# EAGLE design Callisto_RSO_PB_Relay_x_4 (EAGLE 9.6.2)
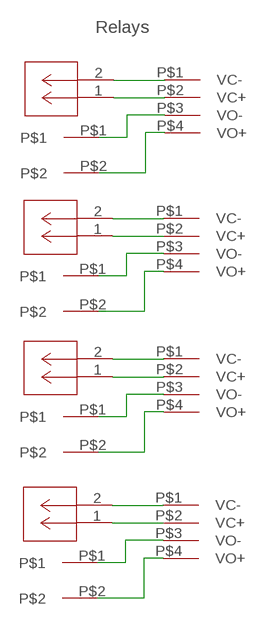
[diagram p0: schematic, sheet 1]

## Parts
J4  CONN_530470210_PICOBLADE_X_2  [CON_530470210_MOL]
J5  2-pos  3.81MM_1_X_2_RT_ANGLE_PLUG_HEADER  [2_3.81MM_PITCH]
J6  CONN_530470210_PICOBLADE_X_2  [CON_530470210_MOL]
J7  2-pos  3.81MM_1_X_2_RT_ANGLE_PLUG_HEADER  [2_3.81MM_PITCH]
J8  CONN_530470210_PICOBLADE_X_2  [CON_530470210_MOL]
J9  2-pos  3.81MM_1_X_2_RT_ANGLE_PLUG_HEADER  [2_3.81MM_PITCH]
J10  CONN_530470210_PICOBLADE_X_2  [CON_530470210_MOL]
J11  2-pos  3.81MM_1_X_2_RT_ANGLE_PLUG_HEADER  [2_3.81MM_PITCH]
U$1  RELAY_KYOTO_KF0604D  [RELAY_KYOTO_KF0604D]
U$2  RELAY_KYOTO_KF0604D  [RELAY_KYOTO_KF0604D]
U$3  RELAY_KYOTO_KF0604D  [RELAY_KYOTO_KF0604D]
U$4  RELAY_KYOTO_KF0604D  [RELAY_KYOTO_KF0604D]

## Nets
N$3: J4.1 U$1.P$2(VC+)
N$4: J4.2 U$1.P$1(VC-)
N$5: J5.P$1 U$1.P$3(VO-)
N$6: J5.P$2 U$1.P$4(VO+)
N$7: J6.1 U$2.P$2(VC+)
N$8: J6.2 U$2.P$1(VC-)
N$9: J7.P$1 U$2.P$3(VO-)
N$10: J7.P$2 U$2.P$4(VO+)
N$11: J8.1 U$3.P$2(VC+)
N$12: J8.2 U$3.P$1(VC-)
N$13: J9.P$1 U$3.P$3(VO-)
N$14: J9.P$2 U$3.P$4(VO+)
N$15: J10.1 U$4.P$2(VC+)
N$16: J10.2 U$4.P$1(VC-)
N$17: J11.P$1 U$4.P$3(VO-)
N$18: J11.P$2 U$4.P$4(VO+)

## Notes on the sheet
- Relays

## Library data of the parts
J4 J6 J8 J10 = 3D_MIG_Controller:CONN_530470210_PICOBLADE_X_2; COPYRIGHT: Copyright (C) 2022 Ultra Librarian. All rights reserved.; MANUFACTURER_PART_NUMBER: 530470210; MFR_NAME: Molex Connector Corporation
J5 J7 J9 J11 = 3D_MIG_Controller:3.81MM_1_X_2_RT_ANGLE_PLUG_HEADER: TERM BLOCK HDR 2POS 90DEG 3.81MM; PARTNO: 691322310002
U$1-U$4 = 3D_MIG_Controller:RELAY_KYOTO_KF0604D

## Board
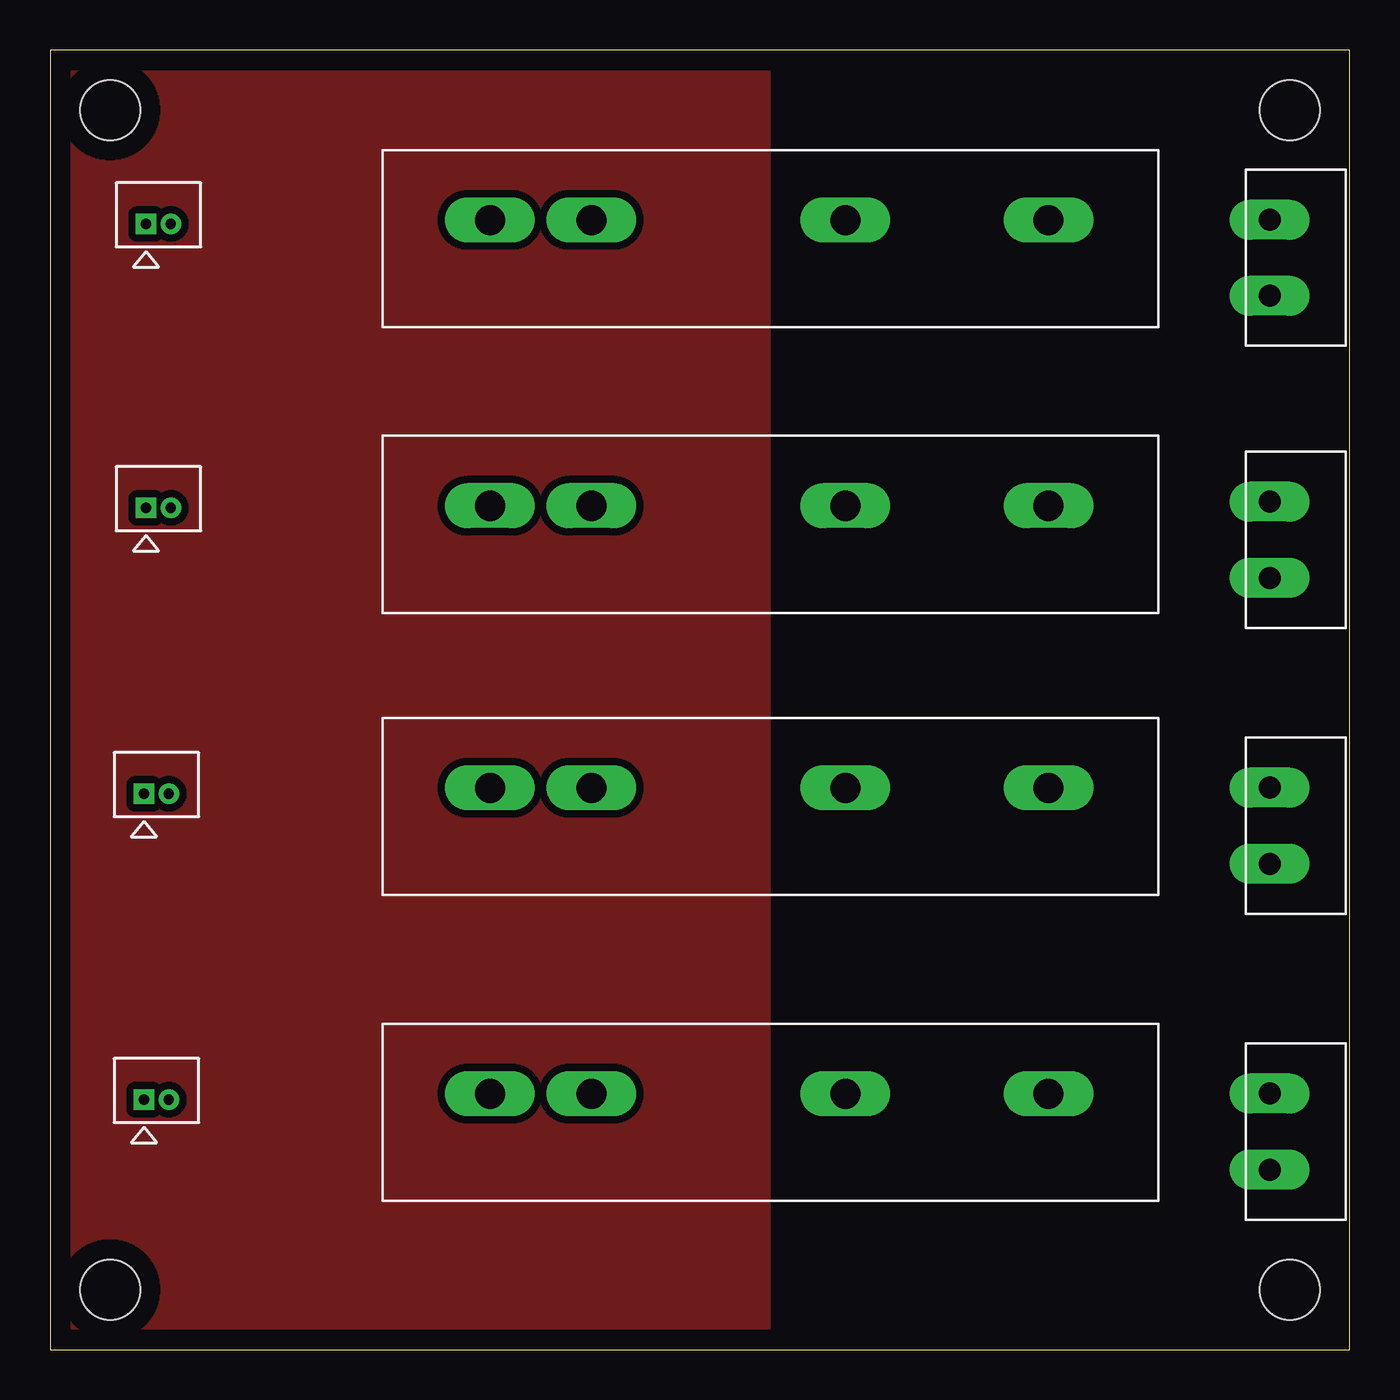
[diagram p1: board, top side]
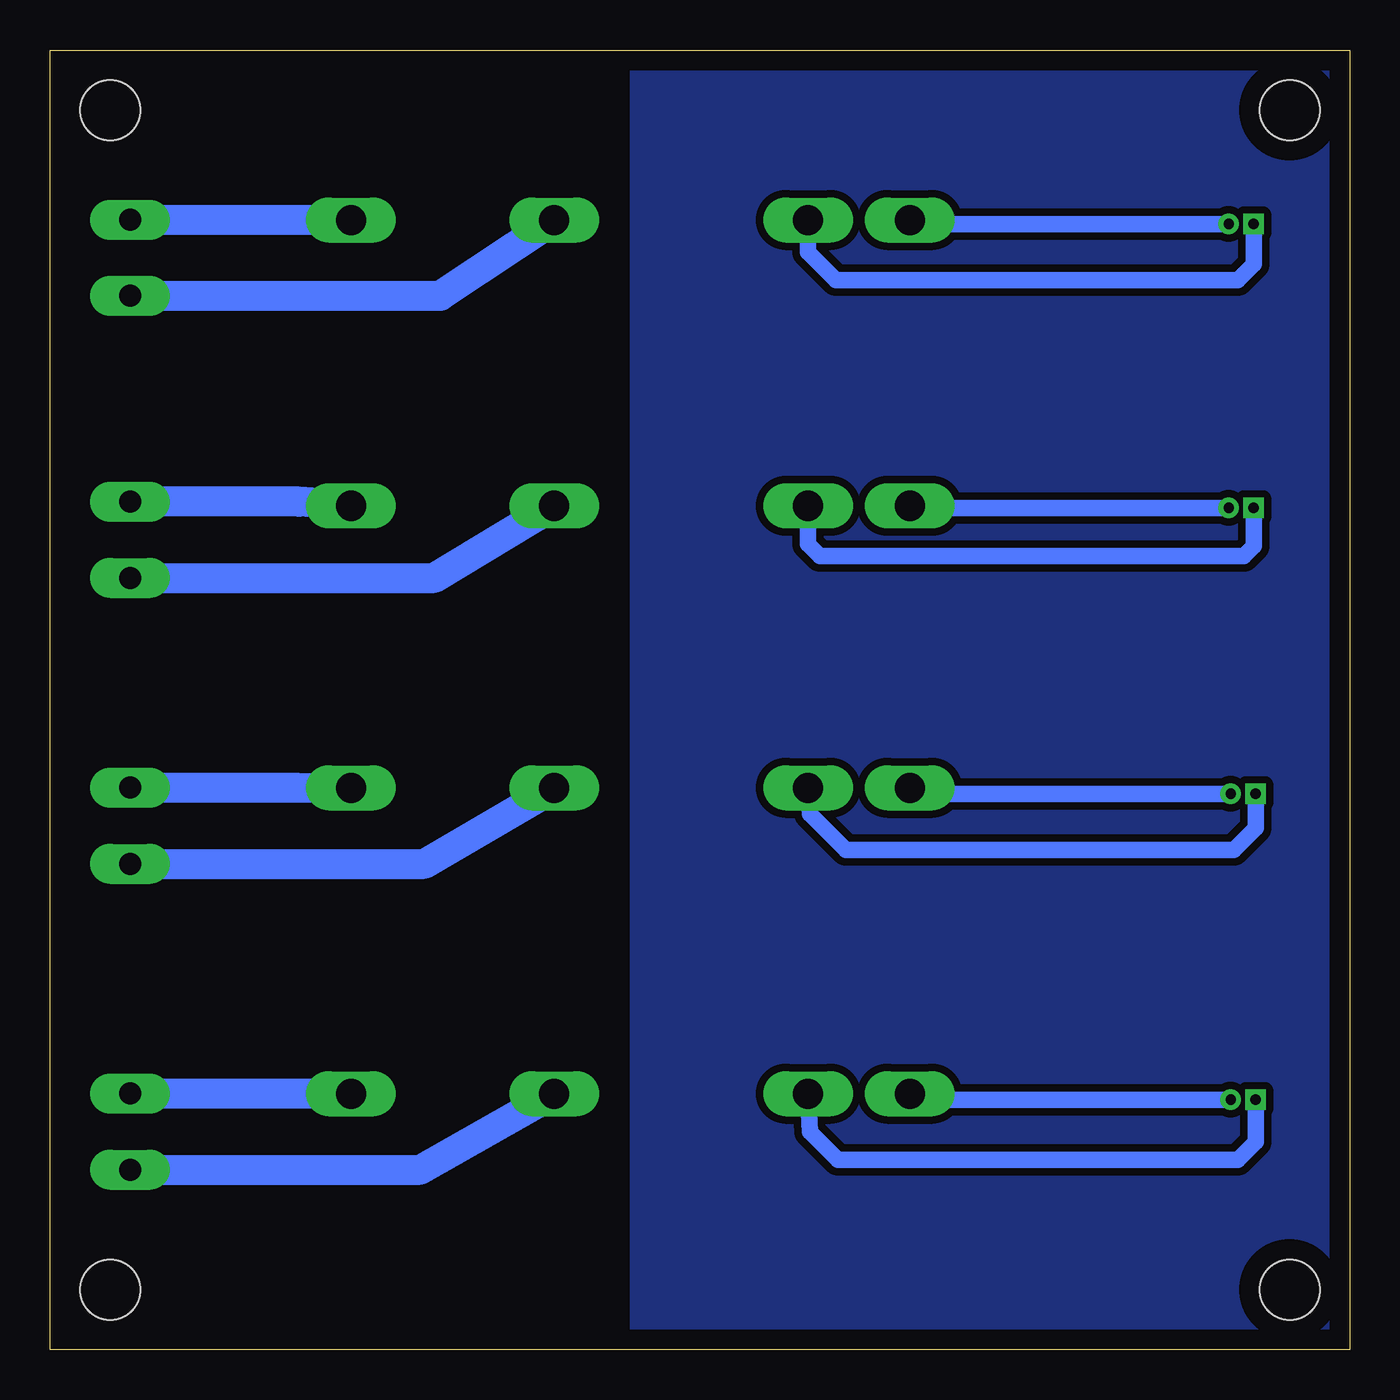
[diagram p2: board, bottom side, seen from below]

Size 65 x 65 mm. Coordinates in mm from the lower left corner, seen from the top.
Outline: 0,0 65,0 65,65 0,65 0,0
Copper layers (1*16): Top 0.035mm / dielectric 1.5mm / Bottom 0.035mm
Design rules "default *": minimum track width 6mil, minimum drill 0.2mm, track to track 15mil, track to pad 15mil, pad to pad 6mil, via to via 6mil, smd to smd 6mil, copper to edge 40mil, drill to drill 6mil, minimum pad ring 10mil, minimum via ring 4mil, stop-mask expansion 4mil, vias tented up to drill 0mil, thermal gap 10mil
Holes 3 mm at 3,3 62,3 62,62 3,62

### Footprints (pad centres in the part's own frame; a part is rotated, then mirrored left to right if it is on the bottom)
CON_530470210_MOL = drill 0.508 pad 0.838 square: 1 0,0 | drill 0.508 pad 0.838: 2 -1.245,0
2_3.81MM_PITCH = drill 1.1 pad 2 long: P$1 0,0; P$2 3.81,0
RELAY_KYOTO_KF0604D = drill 1.5 long: P$1 0,0; P$2 -5.08,0; P$3 -17.78,0; P$4 -27.94,0

### Placement (x,y rotation side)
J4  4.7,12.5 180 top
J5  61,9 90 top
J6  4.7,27.8 180 top
J7  61,24.3 90 top
J8  4.8,42.1 180 top
J9  61,38.6 90 top
J10  4.8,56.3 180 top
J11  61,52.7 90 top
U$1  22,12.8 180 top
U$2  22,28.1 180 top
U$3  22,42.2 180 top
U$4  22,56.5 180 top

### Tracks (layer width: path | path; a pad name or v marks a point on that pad's centre or on a via)
GND
  pour Bottom: 0,0 0,65 36,65 36,0
  pour Top: 0,0 0,65 36,65 36,0
N$3
  Bottom 0.813: J4.1 4.7,10.4 5.6,9.5 25.6,9.5 26.98,10.88 U$1.P$2
N$4
  Bottom 0.813: J4.2 21.6,12.5 U$1.P$1
N$5
  Bottom 1.5: J5.P$1 46.48,9 U$1.P$3
N$6
  Bottom 1.5: U$1.P$4 60.39,12.8 J5.P$2
N$7
  Bottom 0.813: J6.1 4.7,26.1 5.8,25 25.2,25 26.98,26.78 U$2.P$2
N$8
  Bottom 0.813: J6.2 21.6,27.8 U$2.P$1
N$9
  Bottom 1.5: J7.P$1 46.28,24.3 U$2.P$3
N$10
  Bottom 1.5: J7.P$2 52.65,28.11 U$2.P$4
N$11
  Bottom 0.813: J8.1 4.8,40.2 5.3,39.7 26.5,39.7 27.08,40.28 U$3.P$2
N$12
  Bottom 0.813: J8.2 21.9,42.1 U$3.P$1
N$13
  Bottom 1.5: J9.P$1 45.78,38.6 U$3.P$3
N$14
  Bottom 1.5: U$3.P$4 52.55,42.41 J9.P$2
N$15
  Bottom 0.813: J10.1 4.8,54.3 5.6,53.5 25.7,53.5 27.08,54.88 U$4.P$2
N$16
  Bottom 0.813: J10.2 21.8,56.3 U$4.P$1
N$17
  Bottom 1.5: J11.P$1 45.48,52.7 U$4.P$3
N$18
  Bottom 1.5: J11.P$2 51.85,56.51 U$4.P$4